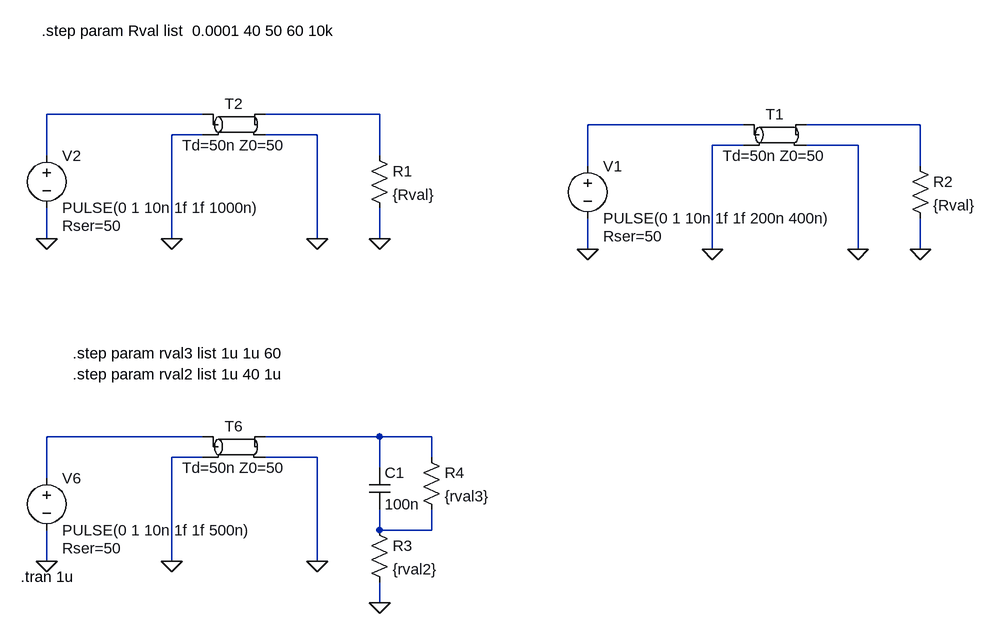
[diagram p0: schematic Draft1.asc]
Draft1.asc, the LTspice schematic file:
Version 4
SHEET 1 3368 868
WIRE 976 96 736 96
WIRE 1248 96 1072 96
WIRE 1808 112 1568 112
WIRE 2080 112 1904 112
WIRE 976 128 928 128
WIRE 1152 128 1072 128
WIRE 1808 144 1760 144
WIRE 1984 144 1904 144
WIRE 736 160 736 96
WIRE 1248 160 1248 96
WIRE 1568 176 1568 112
WIRE 2080 176 2080 112
WIRE 736 288 736 240
WIRE 928 288 928 128
WIRE 1152 288 1152 128
WIRE 1248 288 1248 240
WIRE 1568 304 1568 256
WIRE 1760 304 1760 144
WIRE 1984 304 1984 144
WIRE 2080 304 2080 256
WIRE 976 592 736 592
WIRE 1248 592 1072 592
WIRE 1328 592 1248 592
WIRE 976 624 928 624
WIRE 1152 624 1072 624
WIRE 1328 624 1328 592
WIRE 1248 640 1248 592
WIRE 736 656 736 592
WIRE 1248 736 1248 704
WIRE 1328 736 1328 704
WIRE 1328 736 1248 736
WIRE 736 784 736 736
WIRE 928 784 928 624
WIRE 1152 784 1152 624
WIRE 1248 848 1248 816
FLAG 1248 288 0
FLAG 1152 288 0
FLAG 928 288 0
FLAG 736 288 0
FLAG 1152 784 0
FLAG 928 784 0
FLAG 736 784 0
FLAG 2080 304 0
FLAG 1984 304 0
FLAG 1760 304 0
FLAG 1568 304 0
FLAG 1248 848 0
SYMBOL tline 1024 112 R0
SYMATTR InstName T2
SYMBOL voltage 736 144 R0
WINDOW 123 0 0 Left 0
WINDOW 39 24 124 Left 2
SYMATTR InstName V2
SYMATTR Value PULSE(0 1 10n 1f 1f 1000n)
SYMATTR SpiceLine Rser=50
SYMBOL res 1232 144 R0
SYMATTR InstName R1
SYMATTR Value {Rval}
SYMBOL tline 1024 608 R0
SYMATTR InstName T6
SYMBOL voltage 736 640 R0
WINDOW 123 0 0 Left 0
WINDOW 39 24 124 Left 2
SYMATTR InstName V6
SYMATTR Value PULSE(0 1 10n 1f 1f 500n)
SYMATTR SpiceLine Rser=50
SYMBOL tline 1856 128 R0
SYMATTR InstName T1
SYMBOL voltage 1568 160 R0
WINDOW 123 0 0 Left 0
WINDOW 39 24 124 Left 2
SYMATTR InstName V1
SYMATTR Value PULSE(0 1 10n 1f 1f 200n 400n)
SYMATTR SpiceLine Rser=50
SYMBOL res 2064 160 R0
SYMATTR InstName R2
SYMATTR Value {Rval}
SYMBOL cap 1232 640 R0
SYMATTR InstName C1
SYMATTR Value 100n
SYMBOL res 1312 608 R0
SYMATTR InstName R4
SYMATTR Value {rval3}
SYMBOL res 1232 720 R0
SYMATTR InstName R3
SYMATTR Value {rval2}
TEXT 728 -32 Left 2 !.step param Rval list  0.0001 40 50 60 10k
TEXT 696 808 Left 2 !.tran 1u
TEXT 776 496 Left 2 !.step param rval2 list 1u 40 1u
TEXT 776 464 Left 2 !.step param rval3 list 1u 1u 60

The netlist it stands for:
* Draft1.asc
T2 N001 0 N002 0 Td=50n Z0=50
V2 N001 0 PULSE(0 1 10n 1f 1f 1000n) Rser=50
R1 N002 0 {Rval}
T6 N005 0 N006 0 Td=50n Z0=50
V6 N005 0 PULSE(0 1 10n 1f 1f 500n) Rser=50
T1 N003 0 N004 0 Td=50n Z0=50
V1 N003 0 PULSE(0 1 10n 1f 1f 200n 400n) Rser=50
R2 N004 0 {Rval}
C1 N006 N007 100n
R4 N006 N007 {rval3}
R3 N007 0 {rval2}
.step param Rval list  0.0001 40 50 60 10k
.tran 1u
.step param rval2 list 1u 40 1u
.step param rval3 list 1u 1u 60
.backanno
.end